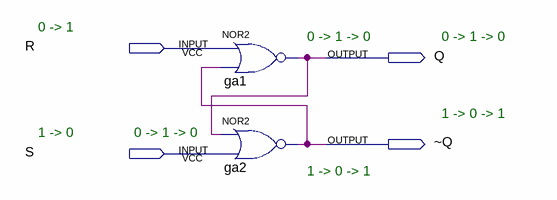
[diagram p0: schematic sheet]
// Quartus schematic ltch.bdf as structural Verilog: 2 symbols, 4 pins
module ltch (
  input  R,
  input  S,
  output Q,
  output \~Q 
);

  nor ga1 (Q, R, \~Q );
  nor ga2 (\~Q , Q, S);

  // Notes on the sheet:
  //   0 -> 1
  //   0 -> 1 -> 0
  //   0 -> 1 -> 0
  //   1 -> 0 -> 1
  //   1 -> 0
  //   0 -> 1 -> 0
  //   1 -> 0 -> 1
endmodule
